# EAGLE schematic hersteld (EAGLE 6.5.0)
REV: 1

## Sheet 1 of 5
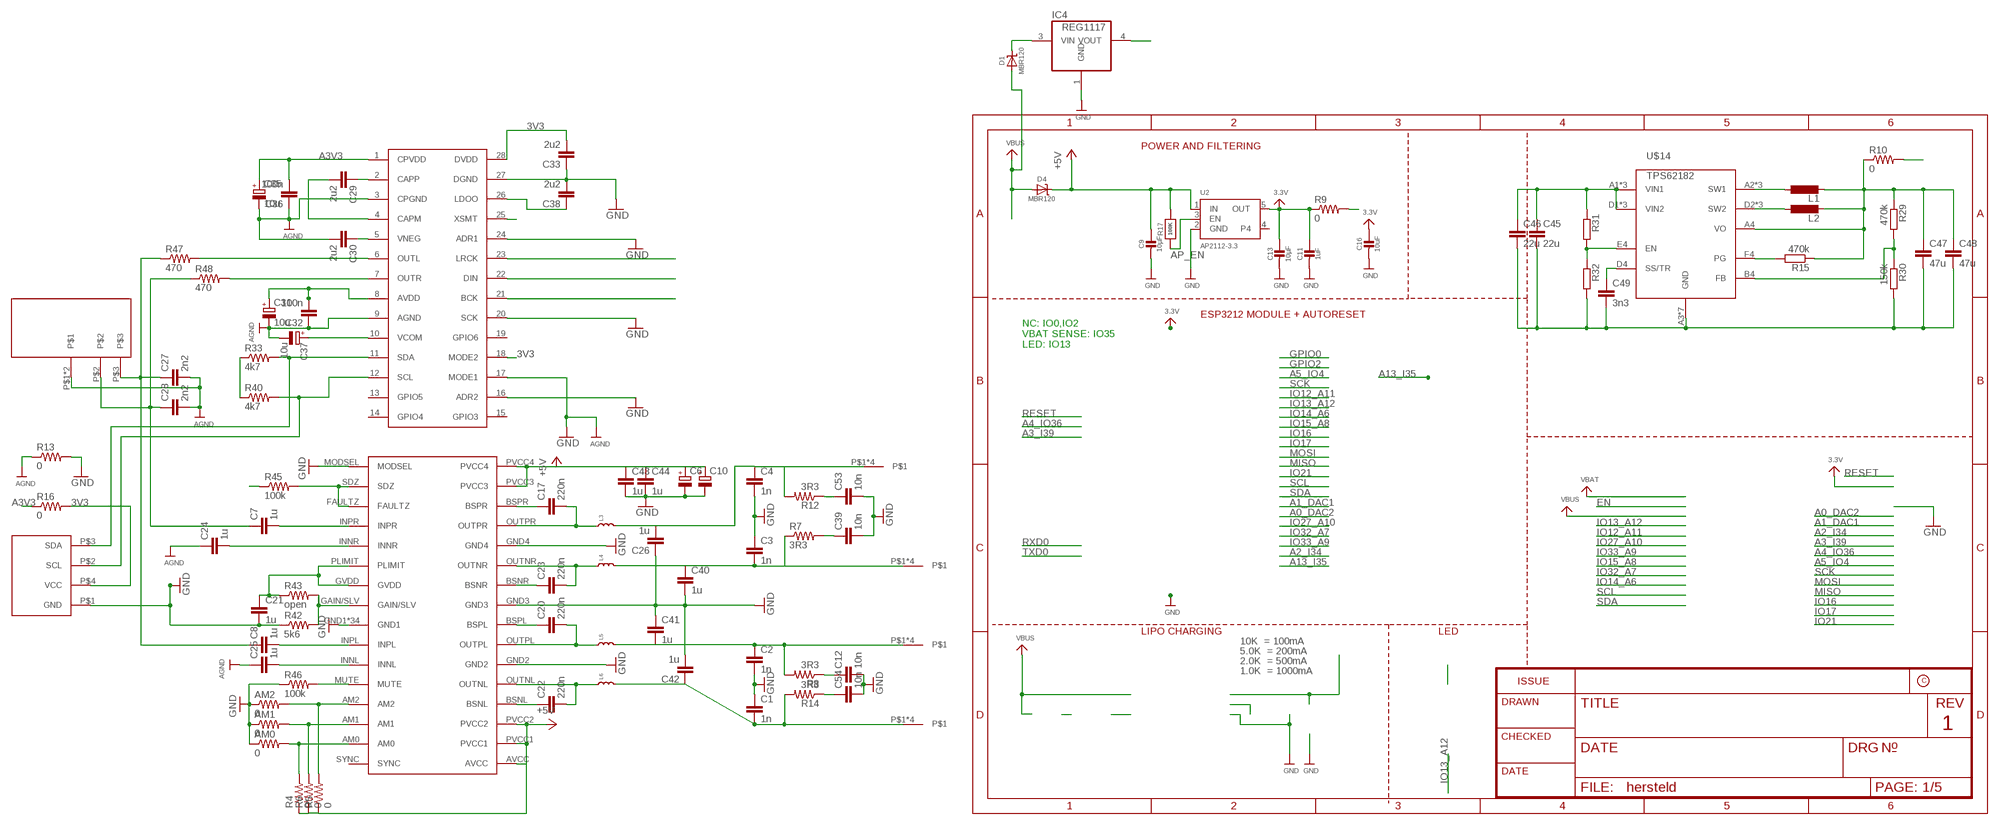
[diagram p0: schematic, sheet 1]

### Parts
AM0  0  R-US_R0402  [R0402]
AM1  0  R-US_R0402  [R0402]
AM2  0  R-US_R0402  [R0402]
C1  1n  C-EUC0805  [C0805]
C2  1n  C-EUC0805  [C0805]
C3  1n  C-EUC0805  [C0805]
C4  1n  C-EUC0805  [C0805]
C6  CPOL-EUE5-13  [E5-13]
C7  1u  C-EUC0805K  [C0805K]
C8  1u  C-EUC0805K  [C0805K]
C9  10µF  CAP_CERAMIC0805-NOOUTLINE  [0805-NO]
C10  CPOL-EUE5-13  [E5-13]
C11  1uF  CAP_CERAMIC0603_NO  [0603-NO]
C12  10n  C-EUC0805  [C0805]
C13  10µF  CAP_CERAMIC0805-NOOUTLINE  [0805-NO]
C16  10uF  CAP_CERAMIC0805-NOOUTLINE  [0805-NO]
C17  220n  C-EUC0805K  [C0805K]
C20  220n  C-EUC0805K  [C0805K]
C21  1u  C-EUC0805K  [C0805K]
C22  220n  C-EUC0805K  [C0805K]
C23  220n  C-EUC0805K  [C0805K]
C24  1u  C-EUC0805K  [C0805K]
C25  1u  C-EUC0805K  [C0805K]
C26  1u  C-EUC1206  [C1206]
C27  2n2  C-EUC0805K  [C0805K]
C28  2n2  C-EUC0805K  [C0805K]
C29  2u2  C-EUC0805K  [C0805K]
C30  2u2  C-EUC0805K  [C0805K]
C31  10u  CPOL-EUUD-4X5,8  [UD-4X5,8_NICHICON]
C32  100n  C-EUC0603K  [C0603K]
C33  2u2  C-EUC1206K  [C1206K]
C35  10u  CPOL-EUUD-4X5,8  [UD-4X5,8_NICHICON]
C36  100n  C-EUC0603K  [C0603K]
C37  10u  CPOL-EUUD-4X5,8  [UD-4X5,8_NICHICON]
C38  2u2  C-EUC1206K  [C1206K]
C39  10n  C-EUC0805  [C0805]
C40  1u  C-EUC1206  [C1206]
C41  1u  C-EUC1206  [C1206]
C42  1u  C-EUC1206  [C1206]
C43  1u  C-EUC1206  [C1206]
C44  1u  C-EUC1206  [C1206]
C45  22u  C-EUC0805K  [C0805K]
C46  22u  C-EUC0805K  [C0805K]
C47  47u  C-EUC0805K  [C0805K]
C48  47u  C-EUC0805K  [C0805K]
C49  3n3  C-EUC0603  [C0603]
C53  10n  C-EUC0805  [C0805]
C54  10n  C-EUC0805  [C0805]
D1  MBR120  DIODE-SCHOTTKYSOD-123  [SOD-123]
D4  MBR120  DIODE-SCHOTTKYSOD-123  [SOD-123]
IC4  REG1117  [SOT223]
L1  L-EUL4532P  [L4532P]
L2  L-EUL4532P  [L4532P]
L3  INDUCTOR-SRN6045  [SRN6045]
L4  INDUCTOR-SRN6045  [SRN6045]
L5  INDUCTOR-SRN6045  [SRN6045]
L6  INDUCTOR-SRN6045  [SRN6045]
R4  0  R-US_R0402  [R0402]
R5  0  R-US_R0402  [R0402]
R6  0  R-US_R0402  [R0402]
R7  3R3  R-US_R0805  [R0805]
R8  3R3  R-US_R0805  [R0805]
R9  0  R-US_R0805  [R0805]
R10  0  R-US_R0805  [R0805]
R12  3R3  R-US_R0805  [R0805]
R13  0  R-US_R0805  [R0805]
R14  3R3  R-US_R0805  [R0805]
R15  470k  R-EU_R0402  [R0402]
R16  0  R-US_R0805  [R0805]
R17  100K  RESISTOR_0603_NOOUT  [0603-NO]
R29  470k  R-EU_R0402  [R0402]
R30  150k  R-EU_R0402  [R0402]
R31  R-EU_R0402  [R0402]
R32  R-EU_R0402  [R0402]
R33  4k7  R-US_R0805  [R0805]
R40  4k7  R-US_R0805  [R0805]
R42  5k6  R-US_R0402  [R0402]
R43  open  R-US_R0402  [R0402]
R45  100k  R-US_R0402  [R0402]
R46  100k  R-US_R0402  [R0402]
R47  470  R-US_R0805  [R0805]
R48  470  R-US_R0805  [R0805]
U1  PCM5122  [TSSOP-28]
U2  AP2112-3.3  VREG_SOT23-5  [SOT23-5]
U4  TPA3130  [TSSOP32-GROUNDPAD]
U$2  DISPLAY  [DISPLAY]
U$9  SCREWCON  [SCREWCON]
U$14  TPS62182  [DSBGA24]
U$15  JACK  [JACK]
U$16  SCREWCON  [SCREWCON]
U$22  SCREWCON  [SCREWCON]
U$23  SCREWCON  [SCREWCON]

### Nets
3.3V: C11.1 C13.1 C16.1 R9.1 U2.5(OUT) ; also sheet 2
3V3 [vcc]: C33.2 R9.2 R10.2 R16.2 R33.1 R40.1 R45.1 U1.18(MODE2) U1.25(XSMT) U1.28(DVDD) U$2.P$4(VCC) ; also sheet 2,5
+5V: C9.1 C45.1 C46.1 D4.C IC4.4(VOUT) R17.2 R31.1 U2.1(IN) U$14.A1(VIN1) U$14.B1(VIN1) U$14.C1(VIN1) U$14.D1(VIN2) U$14.E1(VIN2) U$14.F1(VIN2)
A3V3 [vcc]: C31.+ C32.2 C35.+ C36.2 R16.1 U1.1(CPVDD) U1.8(AVDD)
AGND [gnd]: C24.1 C25.1 C27.2 C28.2 C30.2 C31.- C32.1 C35.- C36.1 C37.- R13.1 U1.3(CPGND) U1.9(AGND) U$15.P$1 U$15.P$6
AP_EN: R17.1 U2.3(EN)
GND [gnd]: AM0.1 AM1.1 AM2.1 C1.1 C2.2 C3.1 C4.2 C6.- C9.2 C10.- C11.2 C12.2 C13.2 C16.2 C21.2 C26.1 C33.1 C38.2 C39.2 C40.2 C41.1 C42.2 C43.2 C44.2 C45.2 C46.2 C47.2 C48.2 C49.2 C53.2 C54.2 IC4.1(GND) R13.2 R30.2 R32.2 R42.1 R46.1 U1.16(ADR2) U1.17(MODE1) U1.20(SCK) U1.24(ADR1) U1.27(DGND) U2.2(GND) U4.GND1 U4.GND2 U4.GND3 U4.GND4 U4.MODSEL U4.P$33(GND1) U4.P$34(GND1) U4.P$35(GND1) U4.P$36(GND1) U4.P$37(GND1) U4.P$38(GND1) U4.P$39(GND1) U4.P$40(GND1) U4.P$41(GND1) U4.P$42(GND1) U4.P$43(GND1) U4.P$44(GND1) U4.P$45(GND1) U4.P$46(GND1) U4.P$47(GND1) U4.P$48(GND1) U4.P$49(GND1) U4.P$50(GND1) U4.P$51(GND1) U4.P$52(GND1) U4.P$53(GND1) U4.P$54(GND1) U4.P$55(GND1) U4.P$56(GND1) U4.P$57(GND1) U4.P$58(GND1) U4.P$59(GND1) U4.P$60(GND1) U4.P$61(GND1) U4.P$62(GND1) U4.P$63(GND1) U4.P$64(GND1) U4.POWERPAD(GND1) U$2.P$1(GND) U$14.A3(GND) U$14.B3(GND) U$14.C3(GND) U$14.C4(GND) U$14.D3(GND) U$14.E3(GND) U$14.F3(GND) ; supply symbol labelled AGND ; also sheet 2,5
IO18: R45.2 U4.FAULTZ U4.SDZ ; also sheet 2
IO25: U1.23(LRCK) ; also sheet 2
IO26: U1.22(DIN) ; also sheet 2
IO27: U1.21(BCK) ; also sheet 2
IO32: R40.2 U1.12(SCL) U$2.P$2(SCL) ; also sheet 2,5
IO33: R33.2 U1.11(SDA) U$2.P$3(SDA) ; also sheet 2,5
LEFT+: C2.1 C41.2 L5.2 R8.2 U$22.P$1 U$22.P$2 U$22.P$3 U$22.P$4
LEFT-: C1.2 C42.1 L6.2 R14.2 U$23.P$1 U$23.P$2 U$23.P$3 U$23.P$4
N$4: C54.1 R14.1
N$6: C53.1 R12.1
N$8: C12.1 R8.1
N$9: C8.1 C27.1 R47.1 U$15.P$3
N$10: C7.1 C28.1 R48.1 U$15.P$2
N$11: C39.1 R7.2
N$12: C7.2 U4.INPR
N$13: C8.2 U4.INPL
N$14: R48.2 U1.7(OUTR)
N$35: C49.1 U$14.D4(SS/TR)
N$39: L1.1 U$14.A2(SW1) U$14.B2(SW1) U$14.C2(SW1)
N$40: L2.1 U$14.D2(SW2) U$14.E2(SW2) U$14.F2(SW2)
N$42: R15.2 U$14.F4(PG)
N$43: R29.2 R30.1 U$14.B4(FB)
N$44: R31.2 R32.1 U$14.E4(EN)
N$49: C24.2 U4.INNR
N$50: C25.2 U4.INNL
N$51: C21.1 R43.1 U4.GVDD U4.PLIMIT
N$52: C17.1 U4.BSPR
N$53: C17.2 L3.1 U4.OUTPR
N$54: C20.1 U4.BSPL
N$55: C20.2 L5.1 U4.OUTPL
N$56: C23.2 L4.1 U4.OUTNR
N$58: C23.1 U4.BSNR
N$59: C22.1 U4.BSNL
N$64: C22.2 L6.1 U4.OUTNL
N$65: R42.2 R43.2 U4.GAIN/SLV
N$67: R46.2 U4.MUTE
N$68: R47.2 U1.6(OUTL)
N$69: C29.2 U1.4(CAPM)
N$70: C29.1 U1.2(CAPP)
N$71: C30.1 U1.5(VNEG)
N$74: C37.+ U1.10(VCOM)
N$75: C38.1 U1.26(LDOO)
N$171 [gnd]: AM0.2 R4.2 U4.AM0
N$172 [gnd]: AM1.2 R6.2 U4.AM1
N$173 [gnd]: AM2.2 R5.2 U4.AM2
OUTDCDC: C47.1 C48.1 L1.2 L2.2 R10.1 R15.1 R29.1 U$14.A4(VO) ; also sheet 2
RIGHT+: C4.1 C26.2 L3.2 R12.2 U$9.P$1 U$9.P$2 U$9.P$3 U$9.P$4
RIGHT-: C3.2 C40.1 L4.2 R7.1 U$16.P$1 U$16.P$2 U$16.P$3 U$16.P$4
VBUS: D1.A D4.A ; also sheet 2
VCC [vcc]: C6.+ C10.+ C43.1 C44.1 D1.C IC4.3(VIN) R4.1 R5.1 R6.1 U4.AVCC U4.PVCC1 U4.PVCC2 U4.PVCC3 U4.PVCC4 ; supply symbol labelled +5V ; also sheet 2
Unconnected: U1.13(GPIO5) U1.14(GPIO4) U1.15(GPIO3) U1.19(GPIO6) U2.4 U4.SYNC

### Notes on the sheet
- POWER AND FILTERING
- ESP3212 MODULE + AUTORESET
- NC: IO0,IO2
  VBAT SENSE: IO35
  LED: IO13
- LIPO CHARGING | LED
- 10K  = 100mA
- 5.0K  = 200mA
- 2.0K  = 500mA
- 1.0K  = 1000mA

## Sheet 2 of 5
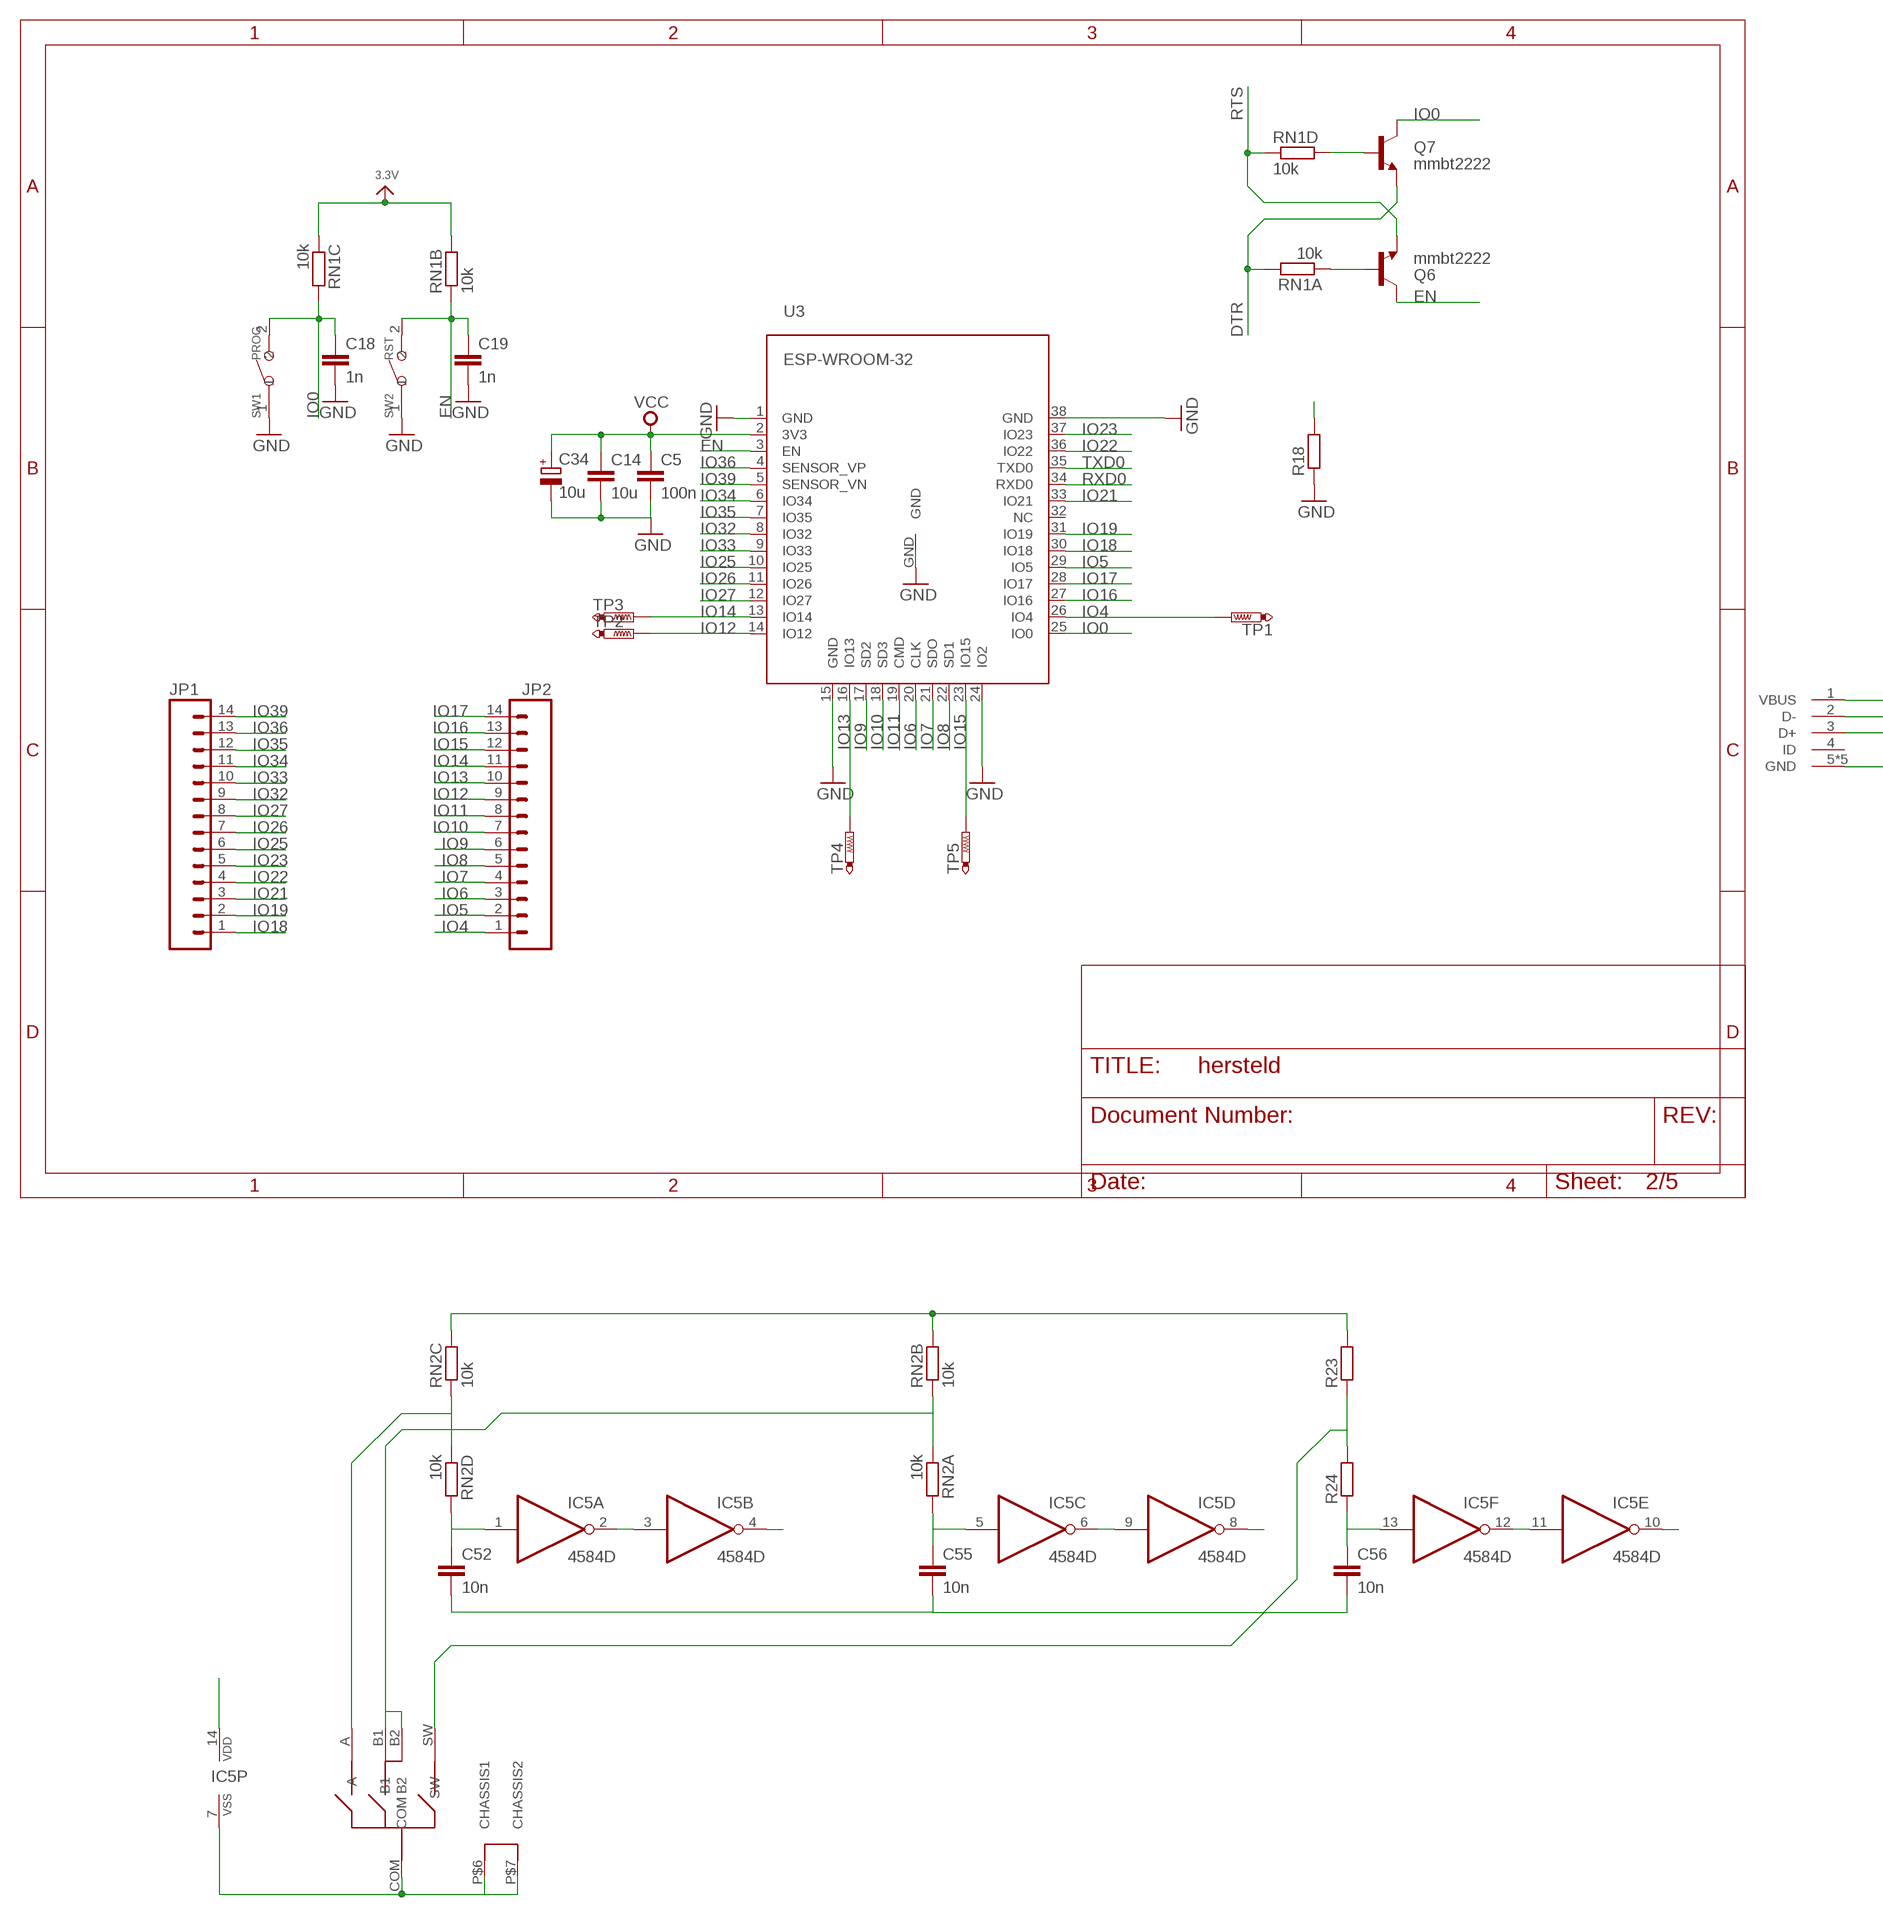
[diagram p1: schematic, sheet 2, part 1 of 2]
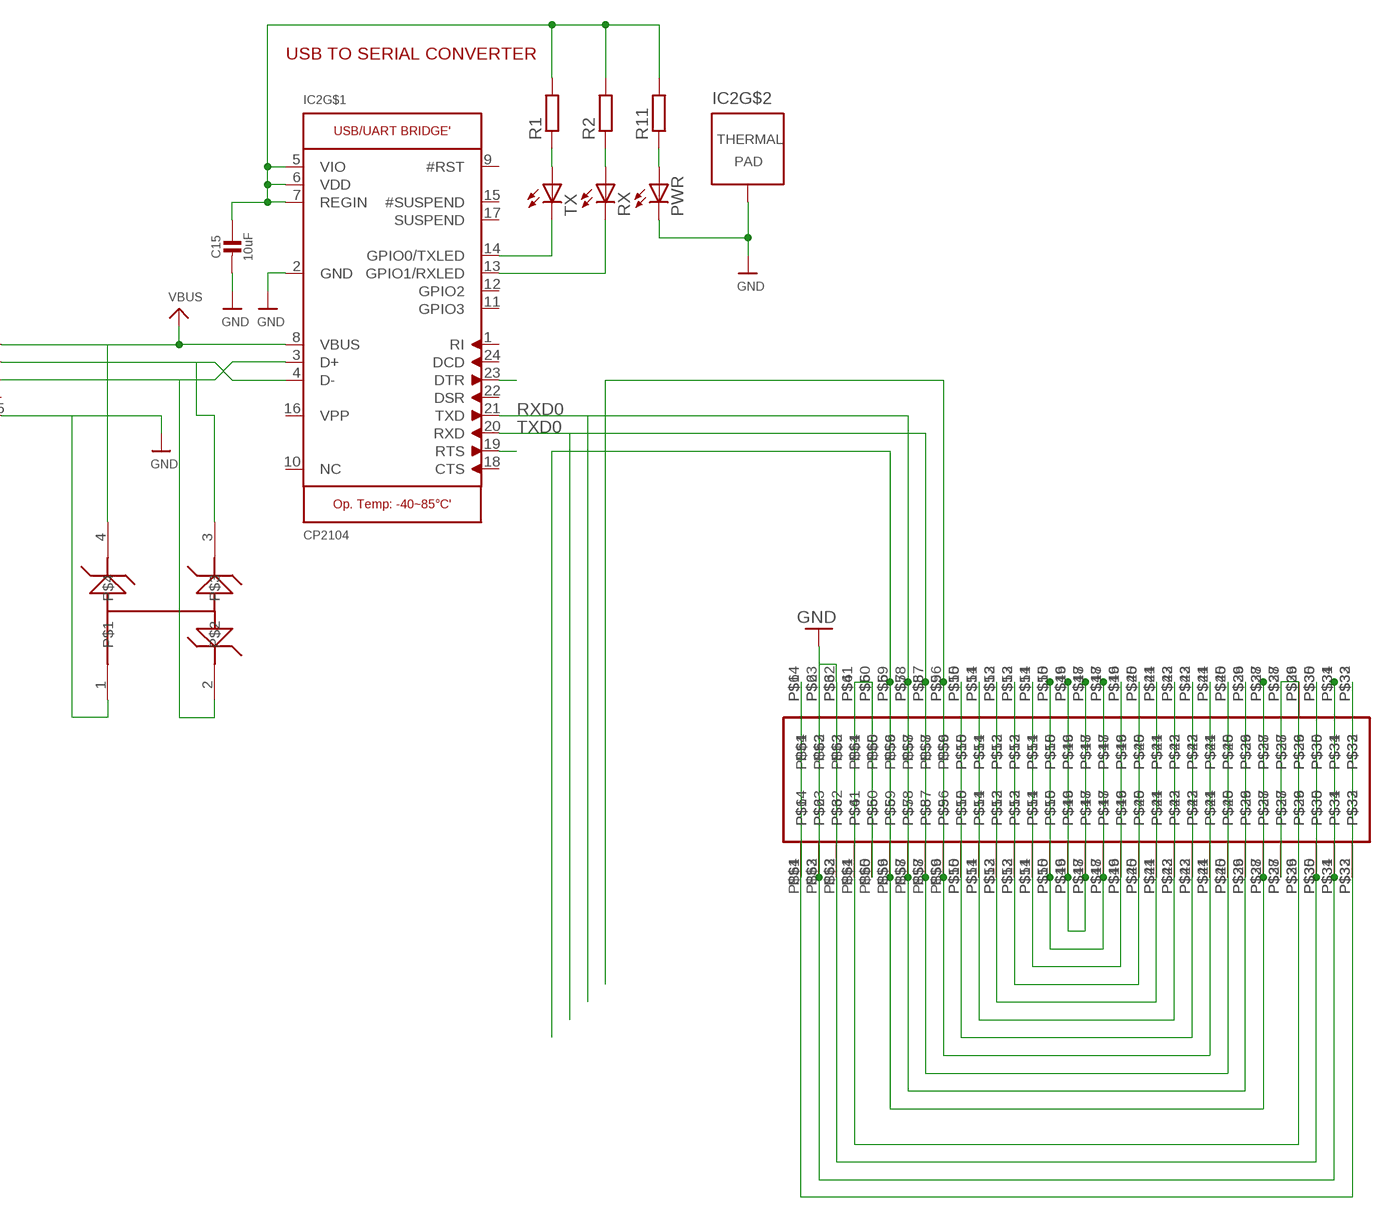
[diagram p2: schematic, sheet 2, part 2 of 2]

### Parts
C5  100n  C-EUC0603  [C0603]
C14  10u  C-EUC0805K  [C0805K]
C15  10uF  CAP_CERAMIC0805-NOOUTLINE  [0805-NO]
C18  1n  C-EUC0603  [C0603]
C19  1n  C-EUC0603  [C0603]
C34  10u  CPOL-EUUD-4X5,8  [UD-4X5,8_NICHICON]
C52  10n  C-EUC0603  [C0603]
C55  10n  C-EUC0603  [C0603]
C56  10n  C-EUC0603  [C0603]
D5  SP0503  [SOT143]
IC2  CP2104  [QFN24_4MM_SMSC]
IC5  4584D  [SO14]
JP1  M14  [1X14]
JP2  M14  [1X14]
PWR  LEDCHIPLED_0603  [CHIPLED_0603]
Q6  mmbt2222  TRANSISTOR_NPNSOT23-3  [SOT23-3]
Q7  mmbt2222  TRANSISTOR_NPNSOT23-3  [SOT23-3]
R1  R-EU_R0402  [R0402]
R2  R-EU_R0402  [R0402]
R11  R-EU_R0402  [R0402]
R18  R-EU_R0402  [R0402]
R23  R-EU_R0603  [R0603]
R24  R-EU_R0603  [R0603]
RN1  10k  RESISTOR_ARRAY_4  [RN8P-4R-CRA06S]
RN2  10k  RESISTOR_ARRAY_4  [RN8P-4R-CRA06S]
RX  LEDCHIPLED_0603  [CHIPLED_0603]
SW1  PROG  SMD-BUTTON(2P-6.0X3.0X2.5MM)-DHT-1163S  [SW2-4.0-6.0X3.0X2.5MM]
SW2  RST  SMD-BUTTON(2P-6.0X3.0X2.5MM)-DHT-1163S  [SW2-4.0-6.0X3.0X2.5MM]
TP1  PTR1B1,27  [B1,27]
TP2  PTR1B1,27  [B1,27]
TP3  PTR1B1,27  [B1,27]
TP4  PTR1B1,27  [B1,27]
TP5  PTR1B1,27  [B1,27]
TX  LEDCHIPLED_0603  [CHIPLED_0603]
U3  ESP-WROOM-32  [ESP-WROOM-32]
U$1  0714360864  [0714360864]
U$13  0714360864  [0714360864]
U$41  ROTARY  [ENCODER]
USB  JRUSB  [MICRO-B-SMT]

### Nets
3.3V: RN1.3 RN1.7 U$1.P$15 U$1.P$18 U$1.P$47 U$1.P$50 U$13.P$15 U$13.P$18 U$13.P$47 U$13.P$50 ; also sheet 1
3V3 [vcc]: C5.1 C14.1 C15.1 C34.+ IC2.5(VIO) IC2.6(VDD) IC2.7(REGIN) IC5.14(P:VDD) R1.2 R2.2 R11.2 R23.2 RN2.6 RN2.7 U3.2(3V3) U$1.P$16 U$1.P$17 U$1.P$48 U$1.P$49 U$13.P$16 U$13.P$17 U$13.P$48 U$13.P$49 ; supply symbol labelled VCC ; also sheet 1,5
DTR: IC2.23(DTR) Q7.2(E) RN1.8
EN: C19.1 Q6.3(C) RN1.2 SW2.2 U3.3(EN) U$1.P$6 U$1.P$27 U$1.P$38 U$1.P$59 U$13.P$6 U$13.P$27 U$13.P$38 U$13.P$59 ; also sheet 1
GND [gnd]: C5.2 C14.2 C15.2 C18.2 C19.2 C34.- C52.2 C55.2 C56.2 D5.1 IC2.2(GND) IC2.THERM(TP) IC5.7(P:VSS) PWR.C R18.1 SW1.1 SW2.1 U3.1(GND) U3.15(GND) U3.24(IO2) U3.38(GND) U3.GND U$1.P$2 U$1.P$3 U$1.P$30 U$1.P$31 U$1.P$34 U$1.P$35 U$1.P$62 U$1.P$63 U$13.P$2 U$13.P$3 U$13.P$30 U$13.P$31 U$13.P$34 U$13.P$35 U$13.P$62 U$13.P$63 U$41.COM U$41.P$6(CHASSIS1) U$41.P$7(CHASSIS2) USB.5(GND) USB.P$6(GND) USB.P$7(GND) USB.P$8(GND) USB.P$9(GND) ; also sheet 1,5
GND1: R18.2
IO0: C18.1 Q7.3(C) RN1.6 SW1.2 U3.25(IO0) U$1.P$9 U$1.P$24 U$1.P$41 U$1.P$56 U$13.P$9 U$13.P$24 U$13.P$41 U$13.P$56
IO4: JP2.1 TP1.TP U3.26(IO4)
IO5: JP2.2 U3.29(IO5)
IO6: JP2.3 U3.20(CLK)
IO7: JP2.4 U3.21(SDO)
IO8: JP2.5 U3.22(SD1)
IO9: JP2.6 U3.17(SD2)
IO10: JP2.7 U3.18(SD3)
IO11: IC5.10(E:O) JP2.8 U3.19(CMD)
IO12: JP2.9 TP2.TP U3.14(IO12)
IO13: JP2.10 TP4.TP U3.16(IO13)
IO14: JP2.11 TP3.TP U3.13(IO14)
IO15: JP2.12 TP5.TP U3.23(IO15)
IO16: IC5.8(D:O) JP2.13 U3.27(IO16) ; also sheet 1
IO17: IC5.4(B:O) JP2.14 U3.28(IO17) ; also sheet 1
IO18: JP1.1 U3.30(IO18) ; also sheet 1
IO19: JP1.2 U3.31(IO19)
IO21: JP1.3 U3.33(IO21) ; also sheet 1
IO22: JP1.4 U3.36(IO22)
IO23: JP1.5 U3.37(IO23)
IO25: JP1.6 U3.10(IO25) ; also sheet 1
IO26: JP1.7 U3.11(IO26) ; also sheet 1
IO27: JP1.8 U3.12(IO27) ; also sheet 1
IO32: JP1.9 U3.8(IO32) ; also sheet 1,5
IO33: JP1.10 U3.9(IO33) ; also sheet 1,5
IO34: JP1.11 U3.6(IO34)
IO35: JP1.12 U3.7(IO35)
IO36: JP1.13 U3.4(SENSOR_VP)
IO39: JP1.14 U3.5(SENSOR_VN)
N$2: RN2.3 RN2.4 U$41.A
N$15: D5.3 IC2.4(D-) USB.2(D-)
N$16: IC5.11(E:I) IC5.12(F:O)
N$17: RN2.1 RN2.2 U$41.B1 U$41.B2
N$18: C52.1 IC5.1(A:I) RN2.5
N$21: D5.2 IC2.3(D+) USB.3(D+)
N$22: C55.1 IC5.5(C:I) RN2.8
N$23: R23.1 R24.2 U$41.SW
N$24: Q7.1(B) RN1.5
N$28: Q6.1(B) RN1.1
N$31: PWR.A R11.1
N$32: IC2.14(GPIO0/TXLED) TX.C
N$34: IC2.13(GPIO1/RXLED) RX.C
N$36: R1.1 TX.A
N$37: U$1.P$10 U$1.P$23 U$1.P$42 U$1.P$55 U$13.P$10 U$13.P$23 U$13.P$42 U$13.P$55
N$38: U$1.P$11 U$1.P$22 U$1.P$43 U$1.P$54 U$13.P$11 U$13.P$22 U$13.P$43 U$13.P$54
N$41: U$1.P$12 U$1.P$21 U$1.P$44 U$1.P$53 U$13.P$12 U$13.P$21 U$13.P$44 U$13.P$53
N$45: U$1.P$13 U$1.P$20 U$1.P$45 U$1.P$52 U$13.P$13 U$13.P$20 U$13.P$45 U$13.P$52
N$46: R2.1 RX.A
N$91: IC5.2(A:O) IC5.3(B:I)
N$92: IC5.6(C:O) IC5.9(D:I)
N$93: C56.1 IC5.13(F:I) R24.1
OUTDCDC: U$1.P$14 U$1.P$19 U$1.P$46 U$1.P$51 U$13.P$14 U$13.P$19 U$13.P$46 U$13.P$51 ; also sheet 1
RTS: IC2.19(RTS) Q6.2(E) RN1.4
RXD0: IC2.21(TXD) U3.34(RXD0) U$1.P$7 U$1.P$26 U$1.P$39 U$1.P$58 U$13.P$7 U$13.P$26 U$13.P$39 U$13.P$58 ; also sheet 1
TXD0: IC2.20(RXD) U3.35(TXD0) U$1.P$8 U$1.P$25 U$1.P$40 U$1.P$57 U$13.P$8 U$13.P$25 U$13.P$40 U$13.P$57 ; also sheet 1
VBUS: D5.4 IC2.8(VBUS) U$1.P$1 U$1.P$32 U$1.P$33 U$1.P$64 U$13.P$1 U$13.P$32 U$13.P$33 U$13.P$64 USB.1(VBUS) ; also sheet 1
VCC [vcc]: U$1.P$4 U$1.P$5 U$1.P$28 U$1.P$29 U$1.P$36 U$1.P$37 U$1.P$60 U$1.P$61 U$13.P$4 U$13.P$5 U$13.P$28 U$13.P$29 U$13.P$36 U$13.P$37 U$13.P$60 U$13.P$61 ; also sheet 1
Unconnected: IC2.1(RI) IC2.9(#RST) IC2.10(NC) IC2.11(GPIO3) IC2.12(GPIO2) IC2.15(#SUSPEND) IC2.16(VPP) IC2.17(SUSPEND) IC2.18(CTS) IC2.22(DSR) IC2.24(DCD) U3.32(NC) USB.4(ID)

### Notes on the sheet
- USB TO SERIAL CONVERTER

## Sheet 3 of 5
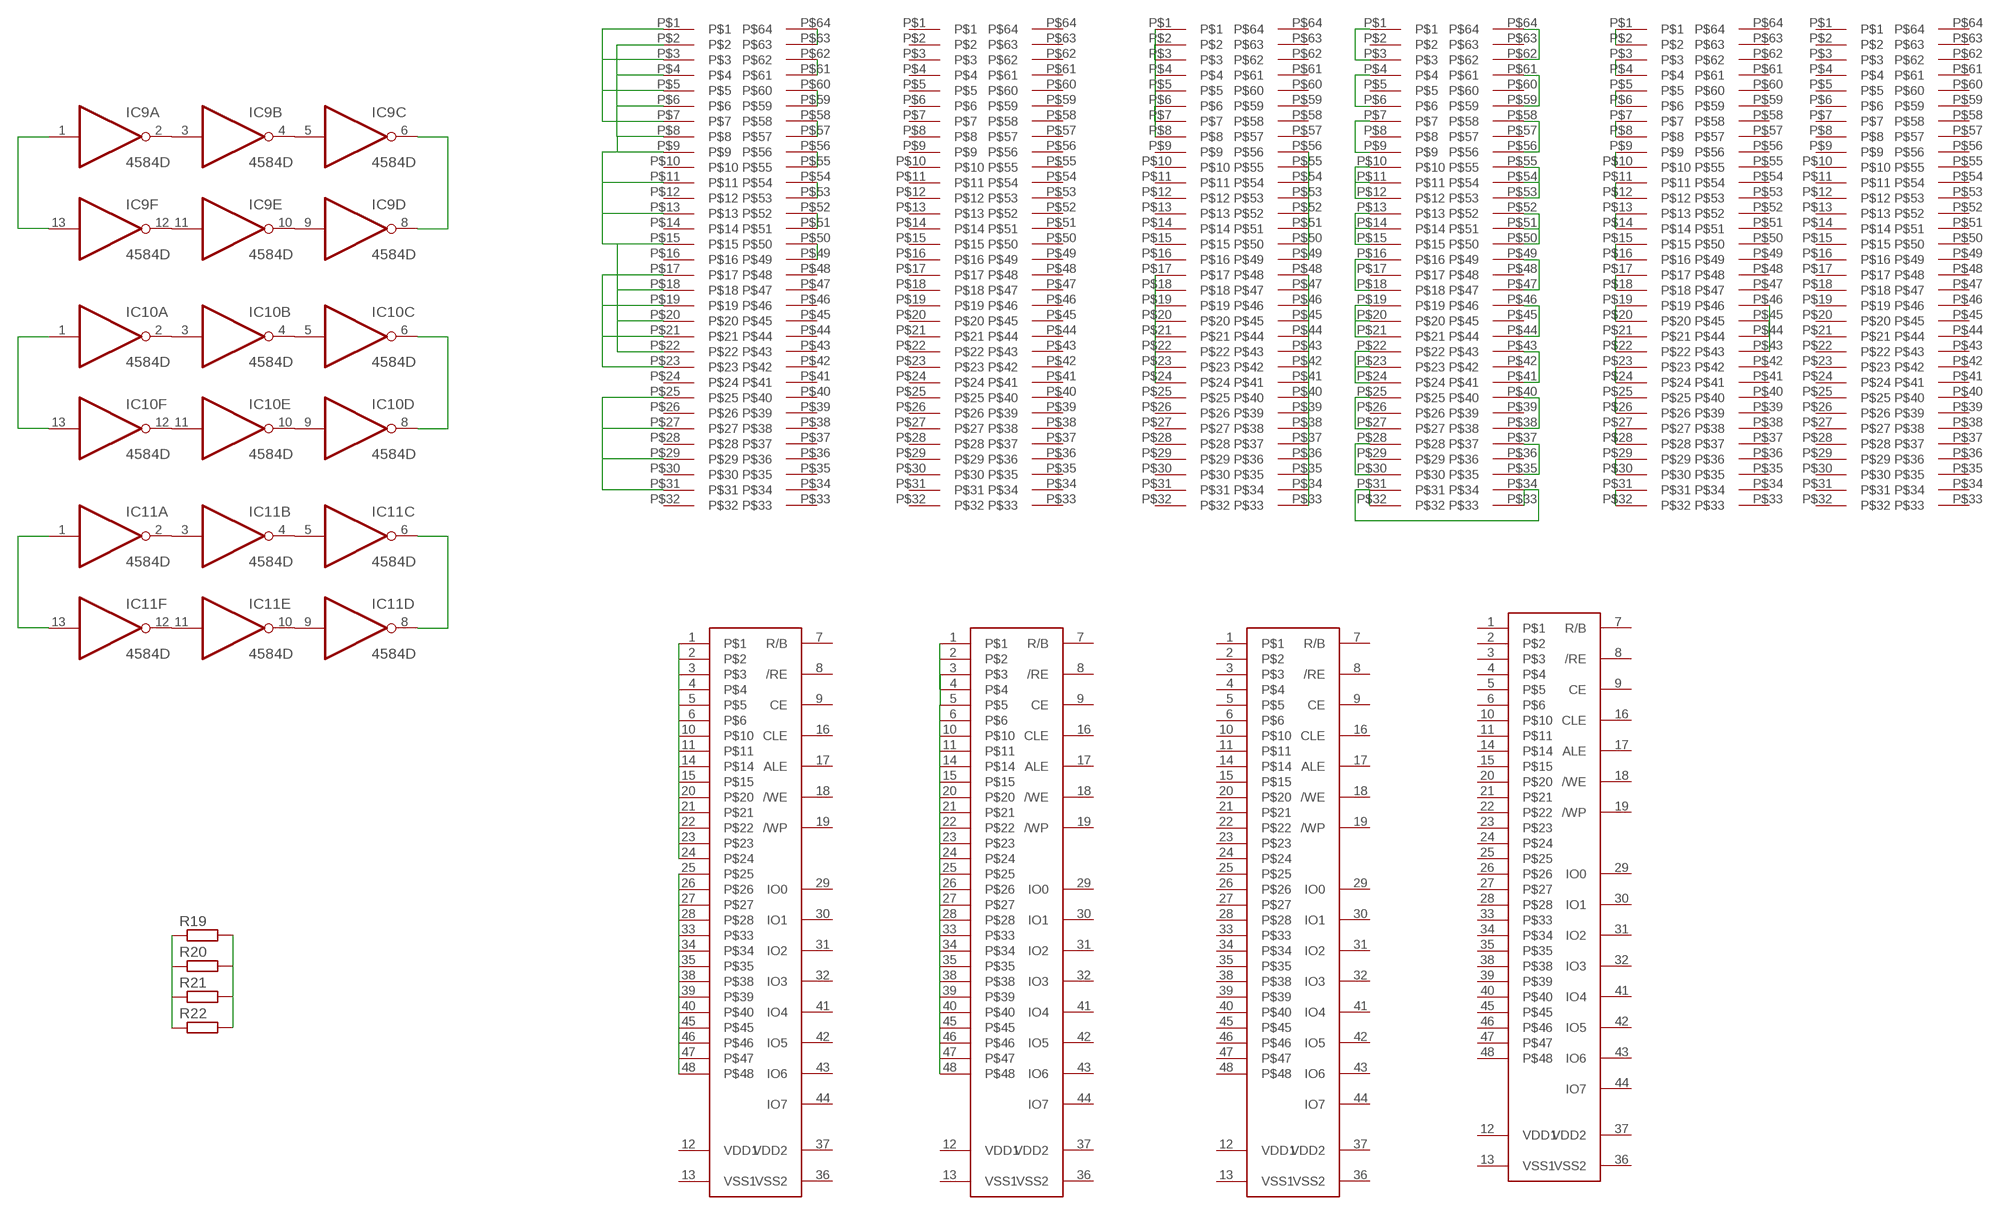
[diagram p3: schematic, sheet 3]

### Parts
IC9  4584D  [SO14]
IC10  4584D  [SO14]
IC11  4584D  [SO14]
IC12  K9F5608  [TSOP48]
IC13  K9F5608  [TSOP48]
IC14  K9F5608  [TSOP48]
IC15  K9F5608  [TSOP48]
R19  R-EU_0207/15  [0207/15]
R20  R-EU_0207/15  [0207/15]
R21  R-EU_0207/15  [0207/15]
R22  R-EU_0207/15  [0207/15]
U$5  BGA64  [BGA64]
U$21  BGA64  [BGA64]
U$24  BGA64  [BGA64]
U$32  BGA64  [BGA64]
U$42  BGA64  [BGA64]
U$43  BGA64  [BGA64]

### Nets
N$47: IC9.2(A:O) IC9.3(B:I)
N$48: IC9.4(B:O) IC9.5(C:I)
N$57: IC9.9(D:I) IC9.10(E:O)
N$66: IC9.6(C:O) IC9.8(D:O)
N$72: IC9.1(A:I) IC9.13(F:I)
N$73: IC9.11(E:I) IC9.12(F:O)
N$76: IC10.2(A:O) IC10.3(B:I)
N$77: IC10.4(B:O) IC10.5(C:I)
N$78: IC10.9(D:I) IC10.10(E:O)
N$79: IC10.6(C:O) IC10.8(D:O)
N$80: IC10.1(A:I) IC10.13(F:I)
N$81: IC10.11(E:I) IC10.12(F:O)
N$82: IC11.2(A:O) IC11.3(B:I)
N$83: IC11.4(B:O) IC11.5(C:I)
N$84: IC11.9(D:I) IC11.10(E:O)
N$85: IC11.6(C:O) IC11.8(D:O)
N$86: IC11.1(A:I) IC11.13(F:I)
N$87: IC11.11(E:I) IC11.12(F:O)
N$88: R19.1 R20.1 R21.1 R22.1
N$89: R19.2 R20.2 R21.2 R22.2
N$90: U$5.P$17 U$5.P$19 U$5.P$21 U$5.P$23
N$94: IC13.1 IC13.2 IC13.3 IC13.4 IC13.5 IC13.6 IC13.10 IC13.11 IC13.14 IC13.15 IC13.20 IC13.21 IC13.22 IC13.23 IC13.24
N$95: U$42.P$27 U$42.P$28
N$96: U$42.P$29 U$42.P$30
N$97: U$42.P$25 U$42.P$26
N$98: U$42.P$23 U$42.P$24
N$99: U$42.P$21 U$42.P$22
N$100: U$42.P$19 U$42.P$20
N$101: U$42.P$17 U$42.P$18
N$102: U$42.P$15 U$42.P$16
N$103: U$42.P$13 U$42.P$14
N$104: U$42.P$11 U$42.P$12
N$105: U$42.P$9 U$42.P$10
N$106: U$42.P$7 U$42.P$8
N$107: U$42.P$5 U$42.P$6
N$108: U$42.P$3 U$42.P$4
N$109: U$42.P$1 U$42.P$2
N$110: U$42.P$31 U$42.P$32
N$111: U$32.P$62 U$32.P$64
N$112: U$32.P$59 U$32.P$61
N$113: U$32.P$56 U$32.P$58
N$114: U$32.P$53 U$32.P$54 U$32.P$55
N$115: U$32.P$50 U$32.P$51 U$32.P$52
N$116: U$32.P$47 U$32.P$49
N$117: U$32.P$44 U$32.P$46
N$118: U$32.P$41 U$32.P$43
N$119: U$32.P$38 U$32.P$40
N$120: U$32.P$35 U$32.P$37
N$130: U$5.P$1 U$5.P$3 U$5.P$5 U$5.P$7
N$131: U$5.P$63 U$5.P$64
N$132: U$5.P$25 U$5.P$27 U$5.P$29 U$5.P$31
N$133: U$5.P$2 U$5.P$4 U$5.P$6 U$5.P$8 U$5.P$9 U$5.P$11 U$5.P$13 U$5.P$15 U$5.P$18 U$5.P$20 U$5.P$22
N$134: U$5.P$61 U$5.P$62
N$135: U$5.P$59 U$5.P$60
N$136: U$5.P$57 U$5.P$58
N$137: U$5.P$55 U$5.P$56
N$138: U$5.P$53 U$5.P$54
N$139: U$5.P$51 U$5.P$52
N$140: U$5.P$49 U$5.P$50
N$141: U$42.P$43 U$42.P$44 U$42.P$45 U$42.P$46
N$142: U$32.P$1 U$32.P$3
N$143: U$32.P$4 U$32.P$6
N$144: U$32.P$7 U$32.P$9
N$145: U$32.P$10 U$32.P$11 U$32.P$12
N$146: U$32.P$13 U$32.P$14 U$32.P$15
N$147: U$32.P$16 U$32.P$18
N$148: U$32.P$19 U$32.P$20 U$32.P$21
N$149: U$32.P$22 U$32.P$23 U$32.P$24
N$150: U$32.P$25 U$32.P$27
N$151: U$32.P$28 U$32.P$30
N$152: U$32.P$31 U$32.P$32 U$32.P$33 U$32.P$34
N$153: U$24.P$1 U$24.P$2 U$24.P$3 U$24.P$4 U$24.P$5 U$24.P$6 U$24.P$7 U$24.P$8
N$154: U$24.P$17 U$24.P$18 U$24.P$19 U$24.P$20 U$24.P$21 U$24.P$22 U$24.P$23 U$24.P$24
N$155: U$24.P$49 U$24.P$50 U$24.P$51 U$24.P$52 U$24.P$53 U$24.P$54 U$24.P$55 U$24.P$56
N$156: U$24.P$33 U$24.P$34 U$24.P$35 U$24.P$36 U$24.P$37 U$24.P$38 U$24.P$39 U$24.P$40 U$24.P$41 U$24.P$42 U$24.P$43 U$24.P$44 U$24.P$45 U$24.P$46 U$24.P$47 U$24.P$48
N$159: IC13.25 IC13.26 IC13.27 IC13.28 IC13.33 IC13.34 IC13.35 IC13.38 IC13.39 IC13.40 IC13.45 IC13.46 IC13.47 IC13.48
N$160: IC14.1 IC14.2 IC14.3 IC14.4 IC14.5 IC14.6 IC14.10 IC14.11 IC14.14 IC14.15 IC14.20 IC14.21 IC14.22 IC14.23 IC14.24 IC14.25 IC14.26 IC14.27 IC14.28 IC14.33 IC14.34 IC14.35 IC14.38 IC14.39 IC14.40 IC14.45 IC14.46 IC14.47 IC14.48
Unconnected: IC12.1 IC12.2 IC12.3 IC12.4 IC12.5 IC12.6 IC12.7(R/B) IC12.8(/RE) IC12.9(CE) IC12.10 IC12.11 IC12.14 IC12.15 IC12.16(CLE) IC12.17(ALE) IC12.18(/WE) IC12.19(/WP) IC12.20 IC12.21 IC12.22 IC12.23 IC12.24 IC12.25 IC12.26 IC12.27 IC12.28 IC12.29(IO0) IC12.30(IO1) IC12.31(IO2) IC12.32(IO3) IC12.33 IC12.34 IC12.35 IC12.38 IC12.39 IC12.40 IC12.41(IO4) IC12.42(IO5) IC12.43(IO6) IC12.44(IO7) IC12.45 IC12.46 IC12.47 IC12.48 IC13.7(R/B) IC13.8(/RE) IC13.9(CE) IC13.16(CLE) IC13.17(ALE) IC13.18(/WE) IC13.19(/WP) IC13.29(IO0) IC13.30(IO1) IC13.31(IO2) IC13.32(IO3) IC13.41(IO4) IC13.42(IO5) IC13.43(IO6) IC13.44(IO7) IC14.7(R/B) IC14.8(/RE) IC14.9(CE) IC14.16(CLE) IC14.17(ALE) IC14.18(/WE) IC14.19(/WP) IC14.29(IO0) IC14.30(IO1) IC14.31(IO2) IC14.32(IO3) IC14.41(IO4) IC14.42(IO5) IC14.43(IO6) IC14.44(IO7) IC15.1 IC15.2 IC15.3 IC15.4 IC15.5 IC15.6 IC15.7(R/B) IC15.8(/RE) IC15.9(CE) IC15.10 IC15.11 IC15.14 IC15.15 IC15.16(CLE) IC15.17(ALE) IC15.18(/WE) IC15.19(/WP) IC15.20 IC15.21 IC15.22 IC15.23 IC15.24 IC15.25 IC15.26 IC15.27 IC15.28 IC15.29(IO0) IC15.30(IO1) IC15.31(IO2) IC15.32(IO3) IC15.33 IC15.34 IC15.35 IC15.38 IC15.39 IC15.40 IC15.41(IO4) IC15.42(IO5) IC15.43(IO6) IC15.44(IO7) IC15.45 IC15.46 IC15.47 IC15.48 U$5.P$10 U$5.P$12 U$5.P$14 U$5.P$16 U$5.P$24 U$5.P$26 U$5.P$28 U$5.P$30 U$5.P$32 U$5.P$33 U$5.P$34 U$5.P$35 U$5.P$36 U$5.P$37 U$5.P$38 U$5.P$39 U$5.P$40 U$5.P$41 U$5.P$42 U$5.P$43 U$5.P$44 U$5.P$45 U$5.P$46 U$5.P$47 U$5.P$48 U$21.P$1 U$21.P$2 U$21.P$3 U$21.P$4 U$21.P$5 U$21.P$6 U$21.P$7 U$21.P$8 U$21.P$9 U$21.P$10 U$21.P$11 U$21.P$12 U$21.P$13 U$21.P$14 U$21.P$15 U$21.P$16 U$21.P$17 U$21.P$18 U$21.P$19 U$21.P$20 U$21.P$21 U$21.P$22 U$21.P$23 U$21.P$24 U$21.P$25 U$21.P$26 U$21.P$27 U$21.P$28 U$21.P$29 U$21.P$30 U$21.P$31 U$21.P$32 U$21.P$33 U$21.P$34 U$21.P$35 U$21.P$36 U$21.P$37 U$21.P$38 U$21.P$39 U$21.P$40 U$21.P$41 U$21.P$42 U$21.P$43 U$21.P$44 U$21.P$45 U$21.P$46 U$21.P$47 U$21.P$48 U$21.P$49 U$21.P$50 U$21.P$51 U$21.P$52 U$21.P$53 U$21.P$54 U$21.P$55 U$21.P$56 U$21.P$57 U$21.P$58 U$21.P$59 U$21.P$60 U$21.P$61 U$21.P$62 U$21.P$63 U$21.P$64 U$24.P$9 U$24.P$10 U$24.P$11 U$24.P$12 U$24.P$13 U$24.P$14 U$24.P$15 U$24.P$16 U$24.P$25 U$24.P$26 U$24.P$27 U$24.P$28 U$24.P$29 U$24.P$30 U$24.P$31 U$24.P$32 U$24.P$57 U$24.P$58 U$24.P$59 U$24.P$60 U$24.P$61 U$24.P$62 U$24.P$63 U$24.P$64 U$32.P$2 U$32.P$5 U$32.P$8 U$32.P$17 U$32.P$26 U$32.P$29 U$32.P$36 U$32.P$39 U$32.P$42 U$32.P$45 U$32.P$48 U$32.P$57 U$32.P$60 U$32.P$63 U$42.P$33 U$42.P$34 U$42.P$35 U$42.P$36 U$42.P$37 U$42.P$38 U$42.P$39 U$42.P$40 U$42.P$41 U$42.P$42 U$42.P$47 U$42.P$48 U$42.P$49 U$42.P$50 U$42.P$51 U$42.P$52 U$42.P$53 U$42.P$54 U$42.P$55 U$42.P$56 U$42.P$57 U$42.P$58 U$42.P$59 U$42.P$60 U$42.P$61 U$42.P$62 U$42.P$63 U$42.P$64 U$43.P$1 U$43.P$2 U$43.P$3 U$43.P$4 U$43.P$5 U$43.P$6 U$43.P$7 U$43.P$8 U$43.P$9 U$43.P$10 U$43.P$11 U$43.P$12 U$43.P$13 U$43.P$14 U$43.P$15 U$43.P$16 U$43.P$17 U$43.P$18 U$43.P$19 U$43.P$20 U$43.P$21 U$43.P$22 U$43.P$23 U$43.P$24 U$43.P$25 U$43.P$26 U$43.P$27 U$43.P$28 U$43.P$29 U$43.P$30 U$43.P$31 U$43.P$32 U$43.P$33 U$43.P$34 U$43.P$35 U$43.P$36 U$43.P$37 U$43.P$38 U$43.P$39 U$43.P$40 U$43.P$41 U$43.P$42 U$43.P$43 U$43.P$44 U$43.P$45 U$43.P$46 U$43.P$47 U$43.P$48 U$43.P$49 U$43.P$50 U$43.P$51 U$43.P$52 U$43.P$53 U$43.P$54 U$43.P$55 U$43.P$56 U$43.P$57 U$43.P$58 U$43.P$59 U$43.P$60 U$43.P$61 U$43.P$62 U$43.P$63 U$43.P$64

## Sheet 4 of 5
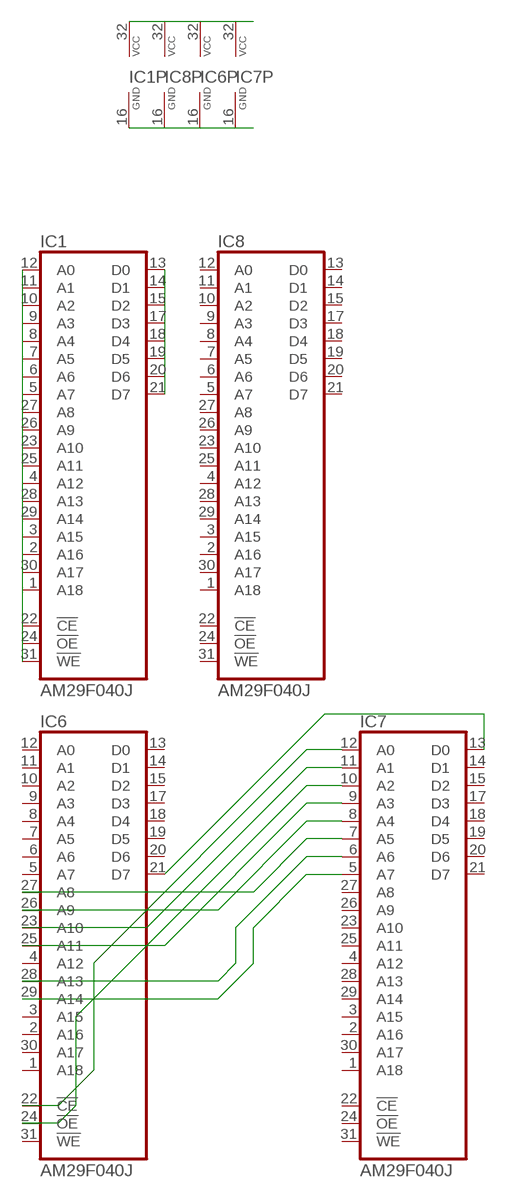
[diagram p4: schematic, sheet 4]

### Parts
IC1  AM29F040J  [PLCC32R]
IC6  AM29F040J  [PLCC32R]
IC7  AM29F040J  [PLCC32R]
IC8  AM29F040J  [PLCC32R]

### Nets
N$29: IC1.16(GND) IC6.16(GND) IC7.16(GND) IC8.16(GND)
N$30: IC1.32(VCC) IC6.32(VCC) IC7.32(VCC) IC8.32(VCC)
N$121: IC6.29(A14) IC7.5(A7)
N$122: IC6.28(A13) IC7.6(A6)
N$123: IC6.27(A8) IC7.7(A5)
N$124: IC6.26(A9) IC7.8(A4)
N$125: IC6.25(A11) IC7.9(A3)
N$126: IC6.24(!OE) IC7.10(A2)
N$127: IC6.23(A10) IC7.11(A1)
N$128: IC6.22(!CE) IC7.12(A0)
N$129: IC6.21(D7) IC7.13(D0)
N$157: IC1.1(A18) IC1.2(A16) IC1.3(A15) IC1.4(A12) IC1.5(A7) IC1.6(A6) IC1.7(A5) IC1.8(A4) IC1.9(A3) IC1.10(A2) IC1.11(A1) IC1.12(A0) IC1.22(!CE) IC1.23(A10) IC1.24(!OE) IC1.25(A11) IC1.26(A9) IC1.27(A8) IC1.28(A13) IC1.29(A14) IC1.30(A17) IC1.31(!WE)
N$158: IC1.13(D0) IC1.14(D1) IC1.15(D2) IC1.17(D3) IC1.18(D4) IC1.19(D5) IC1.20(D6) IC1.21(D7)
Unconnected: IC6.1(A18) IC6.2(A16) IC6.3(A15) IC6.4(A12) IC6.5(A7) IC6.6(A6) IC6.7(A5) IC6.8(A4) IC6.9(A3) IC6.10(A2) IC6.11(A1) IC6.12(A0) IC6.13(D0) IC6.14(D1) IC6.15(D2) IC6.17(D3) IC6.18(D4) IC6.19(D5) IC6.20(D6) IC6.30(A17) IC6.31(!WE) IC7.1(A18) IC7.2(A16) IC7.3(A15) IC7.4(A12) IC7.14(D1) IC7.15(D2) IC7.17(D3) IC7.18(D4) IC7.19(D5) IC7.20(D6) IC7.21(D7) IC7.22(!CE) IC7.23(A10) IC7.24(!OE) IC7.25(A11) IC7.26(A9) IC7.27(A8) IC7.28(A13) IC7.29(A14) IC7.30(A17) IC7.31(!WE) IC8.1(A18) IC8.2(A16) IC8.3(A15) IC8.4(A12) IC8.5(A7) IC8.6(A6) IC8.7(A5) IC8.8(A4) IC8.9(A3) IC8.10(A2) IC8.11(A1) IC8.12(A0) IC8.13(D0) IC8.14(D1) IC8.15(D2) IC8.17(D3) IC8.18(D4) IC8.19(D5) IC8.20(D6) IC8.21(D7) IC8.22(!CE) IC8.23(A10) IC8.24(!OE) IC8.25(A11) IC8.26(A9) IC8.27(A8) IC8.28(A13) IC8.29(A14) IC8.30(A17) IC8.31(!WE)

## Sheet 5 of 5
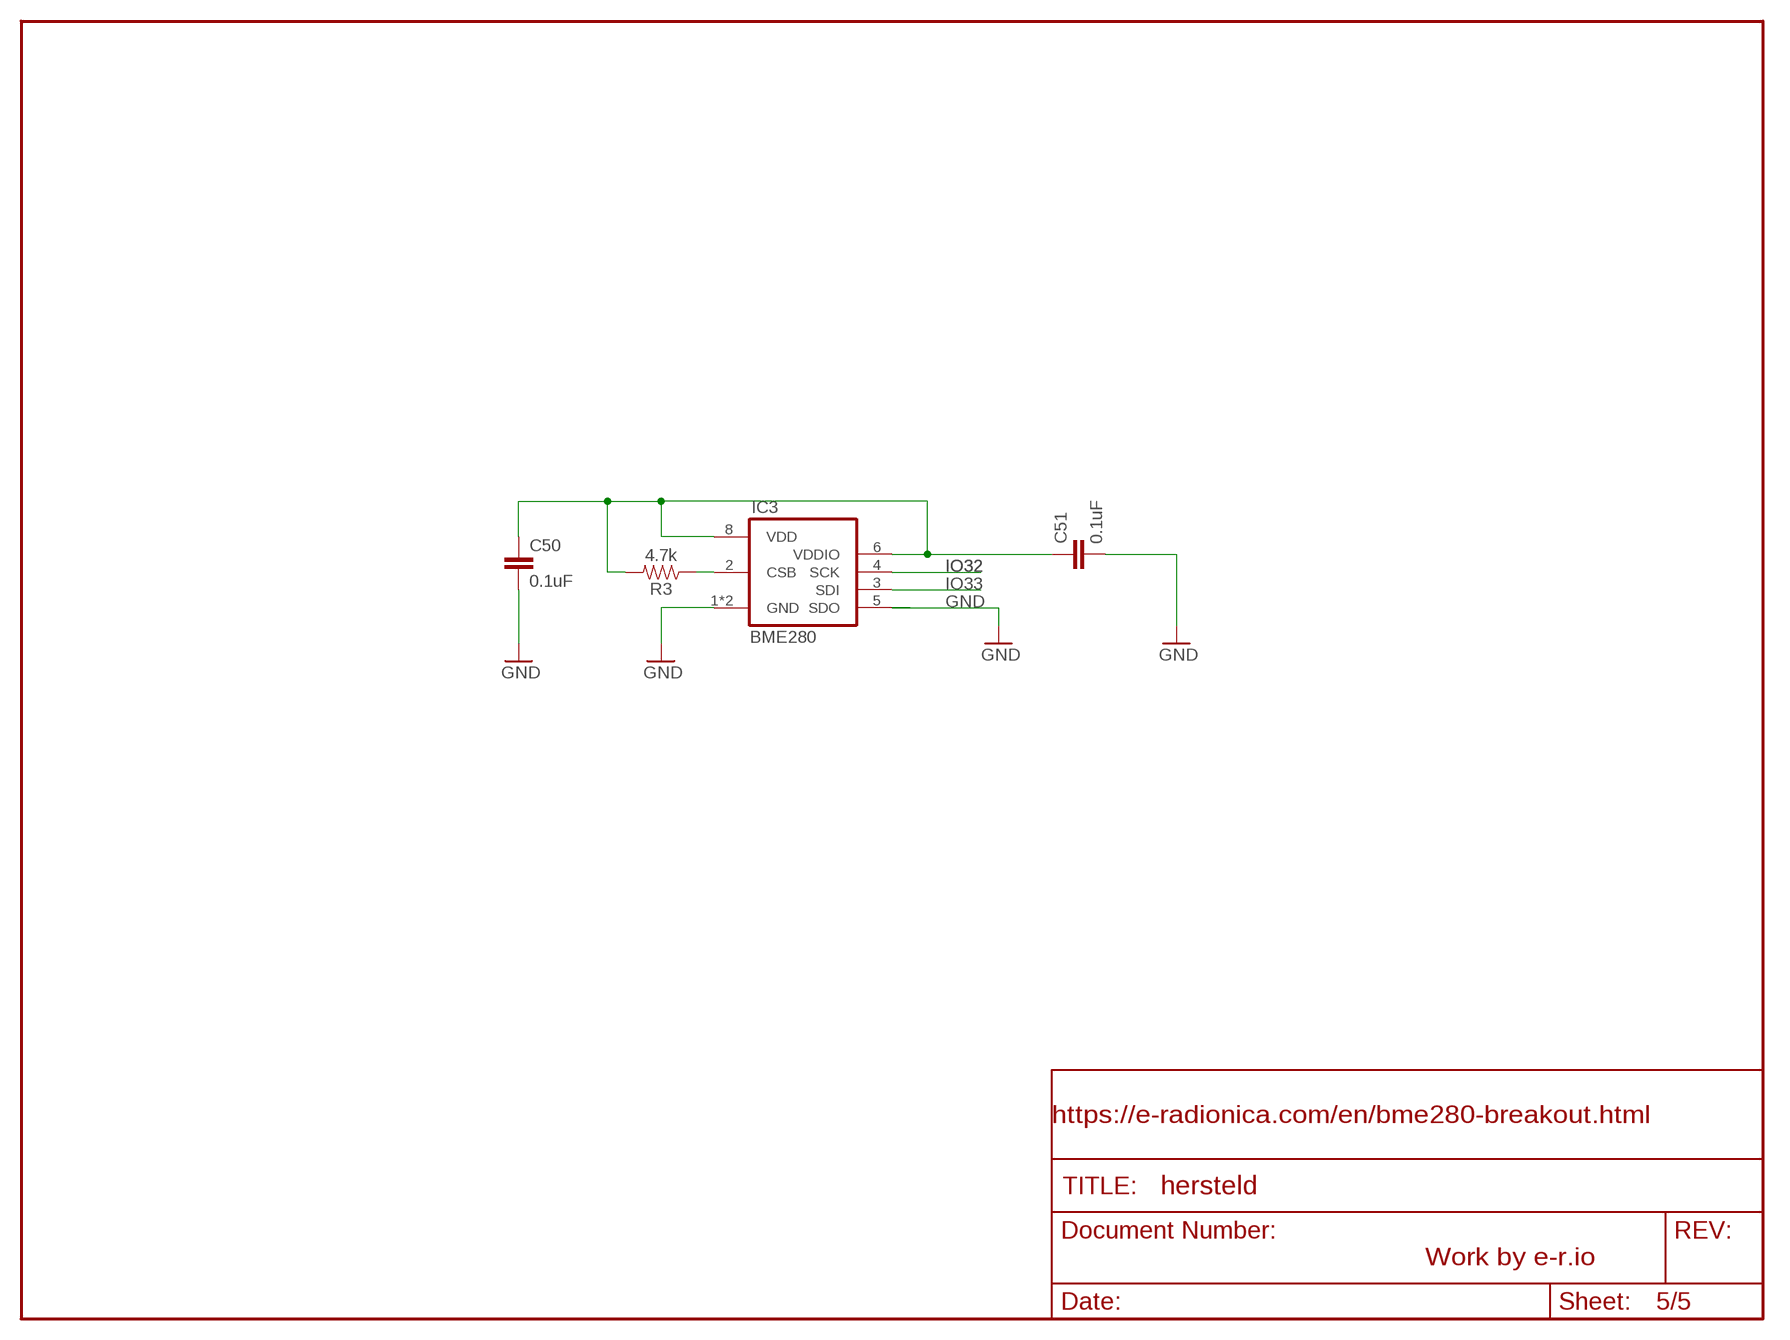
[diagram p5: schematic, sheet 5]

### Parts
C50  0.1uF  0.1UF-0603-25V-(+80/-20%)  [0603]
C51  0.1uF  0.1UF-0603-25V-(+80/-20%)  [0603]
IC3  BME280  [BME280]
R3  4.7k  4.7KOHM-0603-1/10W-1%  [0603]

### Nets
3V3 [vcc]: C50.1 C51.1 IC3.6(VDDIO) IC3.8(VDD) R3.2 ; also sheet 1,2
GND [gnd]: C50.2 C51.2 IC3.1(GND) IC3.5(SDO) IC3.7(GND) ; also sheet 1,2
IO32: IC3.4(SCK) ; also sheet 1,2
IO33: IC3.3(SDI) ; also sheet 1,2
N$33: IC3.2(CSB) R3.1

### Notes on the sheet
- https://e-radionica.com/en/bme280-breakout.html
- Work by e-r.io

## Power pins joined to a net without a drawn wire
VDD: IC9.14(P:VDD) IC10.14(P:VDD) IC11.14(P:VDD)
VDD1: IC12.12(VDD1) IC13.12(VDD1) IC14.12(VDD1) IC15.12(VDD1)
VDD2: IC12.37(VDD2) IC13.37(VDD2) IC14.37(VDD2) IC15.37(VDD2)
VSS: IC9.7(P:VSS) IC10.7(P:VSS) IC11.7(P:VSS)
VSS1: IC12.13(VSS1) IC13.13(VSS1) IC14.13(VSS1) IC15.13(VSS1)
VSS2: IC12.36(VSS2) IC13.36(VSS2) IC14.36(VSS2) IC15.36(VSS2)

## Library data of the parts
AM0 AM1 AM2 R4-R10 R12-R14 R16 R33 R40 R42 R43 R45-R48 = adafruit:R-US_: RESISTOR, American symbol
C1-C5 C7 C8 C12 C14 C17-C30 C32 C33 C36 C38-C49 C52-C56 = rcl:C-EU: CAPACITOR, European symbol
C6 C10 = resistor:CPOL-EU: POLARIZED CAPACITOR, European symbol
C9 C11 C13 C15 C16 = microbuilder:CAP_CERAMIC: Ceramic Capacitors For new designs, use the packages preceded by an '_' character since they are more reliable: The following footprints should be used on most boards: _0402 - Standard footprint for regular board layouts _0603 - Standard footprint for regular board layouts _0805 - Standard footprint for regular board layouts _1206 - Standard footprint for regular board layouts For extremely tight-pitch boards where space is at a premium, the following 'micro-pitch' footprints can be used (smaller pads, no silkscreen outline, etc.): _0402MP - Micro-pitch footprint for very dense/compact boards _0603MP - Micro-pitch footprint for very dense/compact boards _0805MP - Micro-pitch footprint for very dense/compact boards _1206MP - Micro-pitch footprint for very dense/compact boards
C31 C34 C35 C37 = rcl:CPOL-EU: POLARIZED CAPACITOR, European symbol
C50 C51 = SparkFun-Capacitors:0.1UF: 0.1µF ceramic capacitors A capacitor is a passive two-terminal electrical component used to store electrical energy temporarily in an electric field.; PROD_ID: CAP-00810
D1 D4 = microbuilder:DIODE-SCHOTTKY
D5 = jacob:SP0503
IC1 IC6-IC8 = am29-memory:AM29F040J: 4-Megabit FLASH MEMORY (512 K x 8 bit) 5 V-only
IC2 = microbuilder:CP2104: CP2104 - USB to UART Bridge VDD Output: 3.45V
IC3 = bosch-bme280:BME280: DIGITAL HUMIDITY, PRESSURE AND TEMPERATURE SENSOR * Digital interface I²C (up to 3.4 MHz) and SPI (3 and 4 wire, up to 10 MHz)* Supply voltage VDD main supply voltage range: 1.71 V to 3.6 V*VDDIO interface voltage range: 1.2 V to 3.6 V Operating range -40 +85 °C, 0 100 % rel. humidity, 300 1100 hPa The library has been designed by Richard Magdycz <https://www.facebook.com/groups/eaglecadsoftUK>
IC4 = burr-brown:REG1117: 800mA and 1A Low Dropout (LDO) Positive Regulator 1.8V, 2.5V, 2.85V, 3.3V, 5V, and Adj; MPN: REG1117; OC_FARNELL: 1097566; OC_NEWARK: 14P6981
IC5 IC9-IC11 = 45xx:4584: Hex SCHMITT TRIGGER (74C14)
IC12-IC15 = flashmemory:K9F5608
JP1 JP2 = SparkFun-Connectors:M14: Header 14 Standard 14-pin 0.1" header. Use with straight break away headers (SKU : PRT-00116), right angle break away headers (PRT-00553), swiss pins (PRT-00743), machine pins (PRT-00117), and female headers (PRT-00115).
L1 L2 = rcl:L-EU: INDUCTOR, European symbol
L3-L6 = bourns:INDUCTOR
PWR RX TX = adafruit:LED: LED OSRAM: - CHIPLED LG R971, LG N971, LY N971, LG Q971, LY Q971, LO R971, LY R971 LH N974, LH R974 LS Q976, LO Q976, LY Q976 LO Q996 - Hyper CHIPLED LW Q18S LB Q993, LB Q99A, LB R99A - SideLED LS A670, LO A670, LY A670, LG A670, LP A670 LB A673, LV A673, LT A673, LW A673 LH A674 LY A675 LS A676, LA A676, LO A676, LY A676, LW A676 LS A679, LY A679, LG A679 - Hyper Micro SIDELED® LS Y876, LA Y876, LO Y876, LY Y876 LT Y87S - SmartLED LW L88C, LW L88S LB L89C, LB L89S, LG L890 LS L89K, LO L89K, LY L89K LS L896, LA L896, LO L896, LY L896 - TOPLED LS T670, LO T670, LY T670, LG T670, LP T670 LSG T670, LSP T670, LSY T670, LOP T670, LYG T670 LG T671, LOG T671, LSG T671 LB T673, LV T673, LT T673, LW T673 LH T674 LS T676, LA T676, LO T676, LY T676, LB T676, LH T676, LSB T676, LW T676 LB T67C, LV T67C, LT T67C, LS T67K, LO T67K, LY T67K, LW E67C LS E67B, LA E67B, LO E67B, LY E67B, LB E67C, LV E67C, LT E67C LW T67C LS T679, LY T679, LG T679 LS T770, LO T770, LY T770, LG T770, LP T770 LB T773, LV T773, LT T773, LW T773 LH T774 LS E675, LA E675, LY E675, LS T675 LS T776, LA T776, LO T776, LY T776, LB T776 LHGB T686 LT T68C, LB T68C - Hyper Mini TOPLED® LB M676 - Mini TOPLED Santana® LG M470 LS M47K, LO M47K, LY M47K Source: http://www.osram.convergy.de/
Q6 Q7 = SparkFun:TRANSISTOR_NPN: Transistor NPN BJT configuration in SOT23 package. MMBT2222 is the common NPN we use. Double check BCE configuration again layout.
R1 R2 R11 R15 R18-R24 R29-R32 = rcl:R-EU_: RESISTOR, European symbol
R3 = SparkFun-Resistors:4.7KOHM: 4.7kO resistor A resistor is a passive two-terminal electrical component that implements electrical resistance as a circuit element. Resistors act to reduce current flow, and, at the same time, act to lower voltage levels within circuits. - Wikipedia; PROD_ID: RES-07857
R17 = microbuilder:RESISTOR: Resistors For new designs, use the packages preceded by an '_' character since they are more reliable: The following footprints should be used on most boards: _0402 - Standard footprint for regular board layouts _0603 - Standard footprint for regular board layouts _0805 - Standard footprint for regular board layouts _1206 - Standard footprint for regular board layouts For extremely tight-pitch boards where space is at a premium, the following 'micro-pitch' footprints can be used (smaller pads, no silkscreen outline, etc.): _0402MP - Micro-pitch footprint for very dense/compact boards _0603MP - Micro-pitch footprint for very dense/compact boards _0805MP - Micro-pitch footprint for very dense/compact boards _1206MP - Micro-pitch footprint for very dense/compact boards
RN1 RN2 = dp_devices:RESISTOR_ARRAY_4: 4 Resistor Array 0603
SW1 SW2 = Seeed-OPL-Switch:SMD-BUTTON(2P-6.0X3.0X2.5MM): 311020029
TP1-TP5 = testpad:PTR1: TEST PIN
U1 = jacob:PCM5122
U2 = microbuilder:VREG_SOT23-5: SOT23-5 Fixed Voltage Regulators Part Current Out V Out V In V Dropout ?JA (°C/W) TJ (°C) Digikey Part No. ADP121 150mA 3.3V 3.4-5.5V 0.09V @ 150mA -- -- ADP121-AUJZ33R7CT-ND ADP121 150mA 3.0V 3.1-5.5V 0.09V @ 150mA -- -- ADP121-AUJZ30R7CT-ND ADP122 300mA 3.3V 3.4-5.5V 0.085V @ 300mA -- -- ADP122AUJZ-3.3-R7CT-ND ADP1712 300mA 3.3V 3.5-5.5V 0.17V @ 300mA -- -- ADP1712AUJZ-3.3-R7TR-ND AP7311 (Low Cost) 150mA 3.3V 3.5-6V 0.15V @ 150mA -- -- AP7311-33WG-7DICT-ND LD39015M18R 150mA 1.8V 1.9V-5.5V 0.08V @ 100mA -- -- 497-6977-1-ND LP2985A-33DBVR 150mA 3.3V 3.3-16V 0.28V @ 150mA 206 150 296-18479-1-ND MCP1824T-3302E/OT 300mA 3.3V 3.5V-6V 0.2V @ 300mA -- -- MCP1824T-3302E/OTCT-ND MIC5205-2.5YM5 TR 150mA 2.5V 2.7-16V 0.165V @ 150mA -- -- 576-1257-2-ND MIC5205-3.0YM5 TR 150mA 3.0V 3.2V-16V 0.165V @ 150mA -- -- 576-1258-2-ND MIC5205-3.3YM5 TR 150mA 3.3V 3.5V-16V 0.165V @ 150mA -- -- 576-1259-2-ND TPS780330220 150mA 3.3V+2.2V 3.6-5.5V 250mV Max -- -- 296-23332-1-ND TDA3663/N1,135 100mA 3.3V 3.5-45V 0.18V @ 50mA -- -- 568-5343-1-ND Max operating temp can be calculated using ?JA, TJ (max junction temperature), and power in watts. Set the "Maximum Ambient Temperature" until it reaches TJ ("Max Junction Temperature"), which is the absolute limit for safe use of the regulator: Heat Sink Temperature Calculator <http://www.daycounter.com/Calculators/Heat-Sink-Temperature-Calculator.phtml> For example, With 12V source into a 3.3V LP2985 and a 30mA load, we are dissipating (12V-3.3V) * 0.03A = 0.261W. With a ?JA of 206 °C/W, a TJ of 150°C, and 261mW we can safely use the chip without a heat sink up to 75°C (=147.1°C Junction Temperature).
U3 = esp32:ESP-WROOM-32
U4 = jacob:TPA3130
U$1 U$13 = jacob:0714360864
U$2 = jacob:DISPLAY
U$5 U$21 U$24 U$32 U$42 U$43 = jacob:BGA64
U$9 U$16 U$22 U$23 = jacob:SCREWCON
U$14 = TPS6218x:TPS62182
U$15 = jacob:JACK
U$41 = jacob:ROTARY
USB = SparkFun-Connectors:JRUSB

## Net classes
0 default: width 0.152 mm, drill 0.25 mm, clearance 0.152 mm
1 gnd: width 0.254 mm, drill 0.3 mm, clearance 0.152 mm
2 vcc: width 0.254 mm, drill 0.3 mm, clearance 0.152 mm